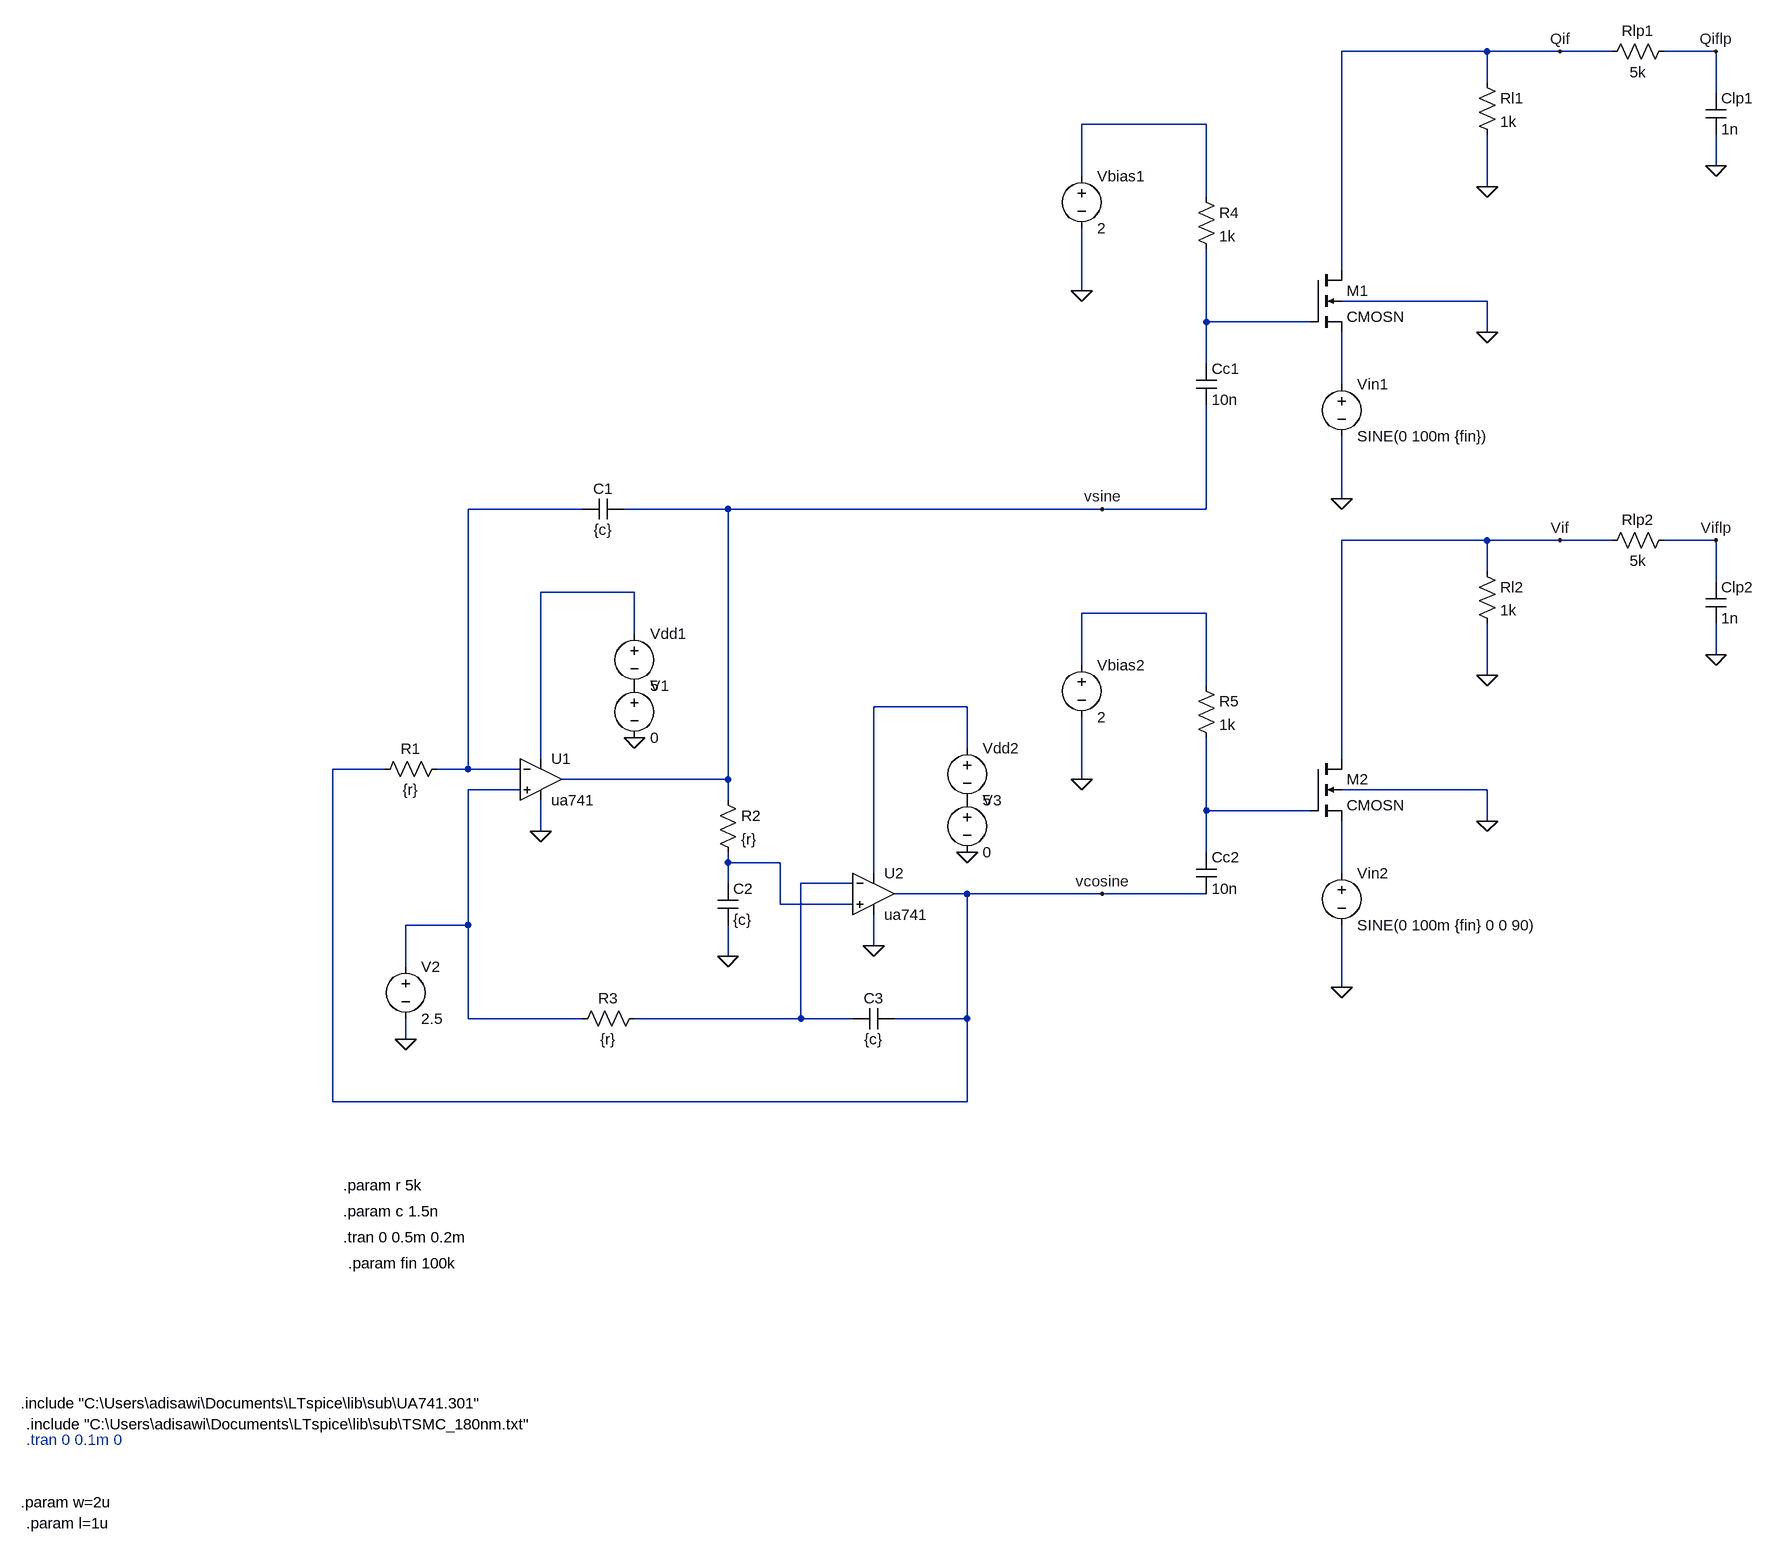
[diagram p0: schematic combined.asc]
combined.asc, the LTspice schematic file:
Version 4
SHEET 1 1936 1288
WIRE 1520 -992 1296 -992
WIRE 1632 -992 1520 -992
WIRE 1712 -992 1632 -992
WIRE 1872 -992 1792 -992
WIRE 1520 -944 1520 -992
WIRE 1872 -928 1872 -992
WIRE 1088 -880 896 -880
WIRE 1872 -816 1872 -864
WIRE 896 -800 896 -880
WIRE 1520 -784 1520 -864
WIRE 1088 -768 1088 -880
WIRE 1296 -656 1296 -992
WIRE 896 -624 896 -720
WIRE 1520 -608 1296 -608
WIRE 1088 -576 1088 -688
WIRE 1248 -576 1088 -576
WIRE 1520 -560 1520 -608
WIRE 1088 -512 1088 -576
WIRE 1296 -480 1296 -560
WIRE 1296 -304 1296 -400
WIRE 128 -288 -48 -288
WIRE 352 -288 192 -288
WIRE 928 -288 352 -288
WIRE 1088 -288 1088 -448
WIRE 1088 -288 928 -288
WIRE 1520 -240 1296 -240
WIRE 1632 -240 1520 -240
WIRE 1712 -240 1632 -240
WIRE 1872 -240 1792 -240
WIRE 1520 -192 1520 -240
WIRE 1872 -176 1872 -240
WIRE 208 -160 64 -160
WIRE 1088 -128 896 -128
WIRE 208 -96 208 -160
WIRE 1872 -64 1872 -112
WIRE 896 -48 896 -128
WIRE 1520 -32 1520 -112
WIRE 1088 -16 1088 -128
WIRE 720 16 576 16
WIRE 720 80 720 16
WIRE 64 96 64 -160
WIRE 1296 96 1296 -240
WIRE -176 112 -256 112
WIRE -48 112 -48 -288
WIRE -48 112 -96 112
WIRE 32 112 -48 112
WIRE 352 128 352 -288
WIRE 352 128 96 128
WIRE 896 128 896 32
WIRE 32 144 -48 144
WIRE 1520 144 1296 144
WIRE 352 160 352 128
WIRE 1088 176 1088 64
WIRE 1248 176 1088 176
WIRE 1520 192 1520 144
WIRE 64 208 64 160
WIRE 1088 240 1088 176
WIRE 352 256 352 240
WIRE 432 256 352 256
WIRE 576 272 576 16
WIRE 1296 272 1296 192
WIRE 352 288 352 256
WIRE 544 288 464 288
WIRE 720 304 608 304
WIRE 928 304 720 304
WIRE 1088 304 928 304
WIRE 432 320 432 256
WIRE 544 320 432 320
WIRE -48 352 -48 144
WIRE -48 352 -144 352
WIRE 576 384 576 336
WIRE 352 400 352 352
WIRE -144 416 -144 352
WIRE 1296 448 1296 352
WIRE -48 496 -48 352
WIRE 128 496 -48 496
WIRE 464 496 464 288
WIRE 464 496 208 496
WIRE 544 496 464 496
WIRE 720 496 720 304
WIRE 720 496 608 496
WIRE -144 528 -144 496
WIRE -256 624 -256 112
WIRE 720 624 720 496
WIRE 720 624 -256 624
FLAG 64 208 0
FLAG 576 384 0
FLAG 352 400 0
FLAG -144 528 0
FLAG 928 -288 vsine
FLAG 928 304 vcosine
FLAG 1520 -560 0
FLAG 1296 -304 0
FLAG 1520 -784 0
FLAG 1632 -992 Qif
FLAG 896 -624 0
FLAG 1872 -816 0
FLAG 1872 -992 Qiflp
FLAG 1520 192 0
FLAG 1296 448 0
FLAG 1520 -32 0
FLAG 1632 -240 Vif
FLAG 896 128 0
FLAG 1872 -64 0
FLAG 1872 -240 Viflp
FLAG 208 64 0
FLAG 720 240 0
SYMBOL OpAmps\\opamp2 64 64 R0
SYMATTR InstName U1
SYMATTR Value ua741
SYMBOL voltage 208 -112 R0
WINDOW 123 0 0 Left 0
WINDOW 39 0 0 Left 0
SYMATTR InstName Vdd1
SYMATTR Value 5
SYMBOL cap 192 -304 R90
WINDOW 0 0 32 VBottom 2
WINDOW 3 32 32 VTop 2
SYMATTR InstName C1
SYMATTR Value {c}
SYMBOL res -80 96 R90
WINDOW 0 0 56 VBottom 2
WINDOW 3 32 56 VTop 2
SYMATTR InstName R1
SYMATTR Value {r}
SYMBOL voltage -144 400 R0
SYMATTR InstName V2
SYMATTR Value 2.5
SYMBOL res 336 144 R0
SYMATTR InstName R2
SYMATTR Value {r}
SYMBOL OpAmps\\opamp2 576 240 R0
SYMATTR InstName U2
SYMATTR Value ua741
SYMBOL voltage 720 64 R0
WINDOW 123 0 0 Left 0
WINDOW 39 0 0 Left 0
SYMATTR InstName Vdd2
SYMATTR Value 5
SYMBOL cap 336 288 R0
SYMATTR InstName C2
SYMATTR Value {c}
SYMBOL res 224 480 R90
WINDOW 0 0 56 VBottom 2
WINDOW 3 32 56 VTop 2
SYMATTR InstName R3
SYMATTR Value {r}
SYMBOL cap 608 480 R90
WINDOW 0 0 32 VBottom 2
WINDOW 3 32 32 VTop 2
SYMATTR InstName C3
SYMATTR Value {c}
SYMBOL nmos4 1248 -656 R0
SYMATTR InstName M1
SYMATTR Value CMOSN
SYMATTR Value2 l={l} w={w} ad={2.5*w*l} as={2.5*w*l} pd={5*l+2*w} ps={5*l+2*w}
SYMBOL voltage 1296 -496 R0
WINDOW 123 0 0 Left 0
WINDOW 39 0 0 Left 0
SYMATTR InstName Vin1
SYMATTR Value SINE(0 100m {fin})
SYMBOL res 1504 -960 R0
SYMATTR InstName Rl1
SYMATTR Value 1k
SYMBOL cap 1072 -512 R0
SYMATTR InstName Cc1
SYMATTR Value 10n
SYMBOL res 1072 -784 R0
SYMATTR InstName R4
SYMATTR Value 1k
SYMBOL voltage 896 -816 R0
SYMATTR InstName Vbias1
SYMATTR Value 2
SYMBOL res 1808 -1008 R90
WINDOW 0 0 56 VBottom 2
WINDOW 3 32 56 VTop 2
SYMATTR InstName Rlp1
SYMATTR Value 5k
SYMBOL cap 1856 -928 R0
SYMATTR InstName Clp1
SYMATTR Value 1n
SYMBOL nmos4 1248 96 R0
SYMATTR InstName M2
SYMATTR Value CMOSN
SYMATTR Value2 l={l} w={w} ad={2.5*w*l} as={2.5*w*l} pd={5*l+2*w} ps={5*l+2*w}
SYMBOL voltage 1296 256 R0
WINDOW 123 0 0 Left 0
WINDOW 39 0 0 Left 0
SYMATTR InstName Vin2
SYMATTR Value SINE(0 100m {fin} 0 0 90)
SYMBOL res 1504 -208 R0
SYMATTR InstName Rl2
SYMATTR Value 1k
SYMBOL cap 1072 240 R0
SYMATTR InstName Cc2
SYMATTR Value 10n
SYMBOL res 1072 -32 R0
SYMATTR InstName R5
SYMATTR Value 1k
SYMBOL voltage 896 -64 R0
SYMATTR InstName Vbias2
SYMATTR Value 2
SYMBOL res 1808 -256 R90
WINDOW 0 0 56 VBottom 2
WINDOW 3 32 56 VTop 2
SYMATTR InstName Rlp2
SYMATTR Value 5k
SYMBOL cap 1856 -176 R0
SYMATTR InstName Clp2
SYMATTR Value 1n
SYMBOL voltage 208 -32 R0
WINDOW 123 0 0 Left 0
WINDOW 39 0 0 Left 0
SYMATTR InstName V1
SYMATTR Value 0
SYMBOL voltage 720 144 R0
WINDOW 123 0 0 Left 0
WINDOW 39 0 0 Left 0
SYMATTR InstName V3
SYMATTR Value 0
TEXT -736 1088 Left 2 !.include "C:\\Users\\adisawi\\Documents\\LTspice\\lib\\sub\\UA741.301"
TEXT -240 752 Left 2 !.param r 5k
TEXT -240 792 Left 2 !.param c 1.5n
TEXT -240 832 Left 2 !.tran 0 0.5m 0.2m
TEXT -728 1120 Left 2 !.include "C:\\Users\\adisawi\\Documents\\LTspice\\lib\\sub\\TSMC_180nm.txt"
TEXT -728 1144 Left 2 ;.tran 0 0.1m 0
TEXT -736 1240 Left 2 !.param w=2u
TEXT -728 1272 Left 2 !.param l=1u
TEXT -232 872 Left 2 !.param fin 100k

The netlist it stands for:
* combined.asc
XU1 N008 N004 N005 0 vsine ua741  ; pins In+ In- V+ V- OUT
Vdd1 N005 P001 5
C1 vsine N004 {c}
R1 N004 vcosine {r}
V2 N008 0 2.5
R2 vsine N010 {r}
XU2 N010 N012 N007 0 vcosine ua741  ; pins In+ In- V+ V- OUT
Vdd2 N007 P002 5
C2 N010 0 {c}
R3 N012 N008 {r}
C3 vcosine N012 {c}
M1 Qif N002 N003 0 CMOSN l={l} w={w} ad={2.5*w*l} as={2.5*w*l} pd={5*l+2*w} ps={5*l+2*w}
Vin1 N003 0 SINE(0 100m {fin})
Rl1 Qif 0 1k
Cc1 N002 vsine 10n
R4 N001 N002 1k
Vbias1 N001 0 2
Rlp1 Qiflp Qif 5k
Clp1 Qiflp 0 1n
M2 Vif N009 N011 0 CMOSN l={l} w={w} ad={2.5*w*l} as={2.5*w*l} pd={5*l+2*w} ps={5*l+2*w}
Vin2 N011 0 SINE(0 100m {fin} 0 0 90)
Rl2 Vif 0 1k
Cc2 N009 vcosine 10n
R5 N006 N009 1k
Vbias2 N006 0 2
Rlp2 Viflp Vif 5k
Clp2 Viflp 0 1n
V1 P001 0 0
V3 P002 0 0
.model NMOS NMOS
.model PMOS PMOS
.lib standard.mos
.include "C:\Users\adisawi\Documents\LTspice\lib\sub\UA741.301"
.param r 5k
.param c 1.5n
.tran 0 0.5m 0.2m
.include "C:\Users\adisawi\Documents\LTspice\lib\sub\TSMC_180nm.txt"
* .tran 0 0.1m 0
.param w=2u
.param l=1u
.param fin 100k
.backanno
.end